# Altium schematic sheet Top.SchDoc
size A4
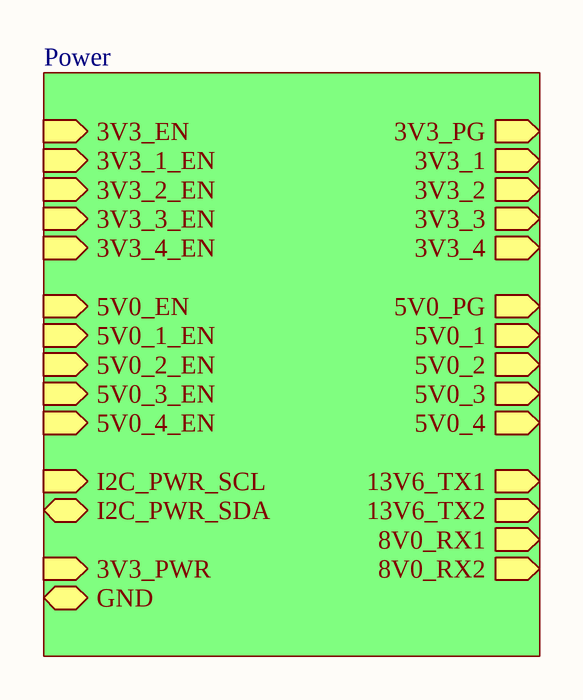
[diagram p0: Top.SchDoc]

## Sub-sheets
Power = Power.SchDoc: 5V0_1 (out), 3V3_1 (out), 5V0_2 (out), 3V3_2 (out), 5V0_3 (out), 3V3_3 (out), 5V0_4 (out), 3V3_4 (out), 5V0_PG (out), 3V3_PG (out), GND, 13V6_TX1 (out), 8V0_RX1 (out), 13V6_TX2 (out), 8V0_RX2 (out), 5V0_EN (in), 3V3_EN (in), 5V0_1_EN (in), 5V0_2_EN (in), 5V0_3_EN (in), 5V0_4_EN (in), 3V3_1_EN (in), 3V3_2_EN (in), 3V3_3_EN (in), 3V3_4_EN (in), I2C_PWR_SCL (in), I2C_PWR_SDA (bidir), 3V3_PWR (in)